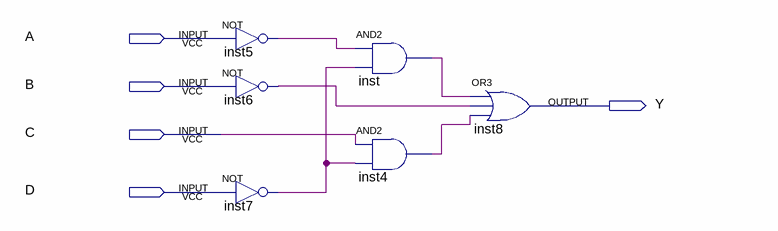
[diagram p0: schematic sheet]
// Quartus schematic bouns.bdf as structural Verilog: 6 symbols, 5 pins
module bouns (
  input  A,
  input  B,
  input  C,
  input  D,
  output Y
);

  wire inst4_out, inst5_out, inst6_out, inst7_out, inst_out;

  not inst5 (inst5_out, A);
  not inst6 (inst6_out, B);
  not inst7 (inst7_out, D);
  and inst (inst_out, inst5_out, inst7_out);
  and inst4 (inst4_out, C, inst7_out);
  or inst8 (Y, inst_out, inst6_out, inst4_out);
endmodule
